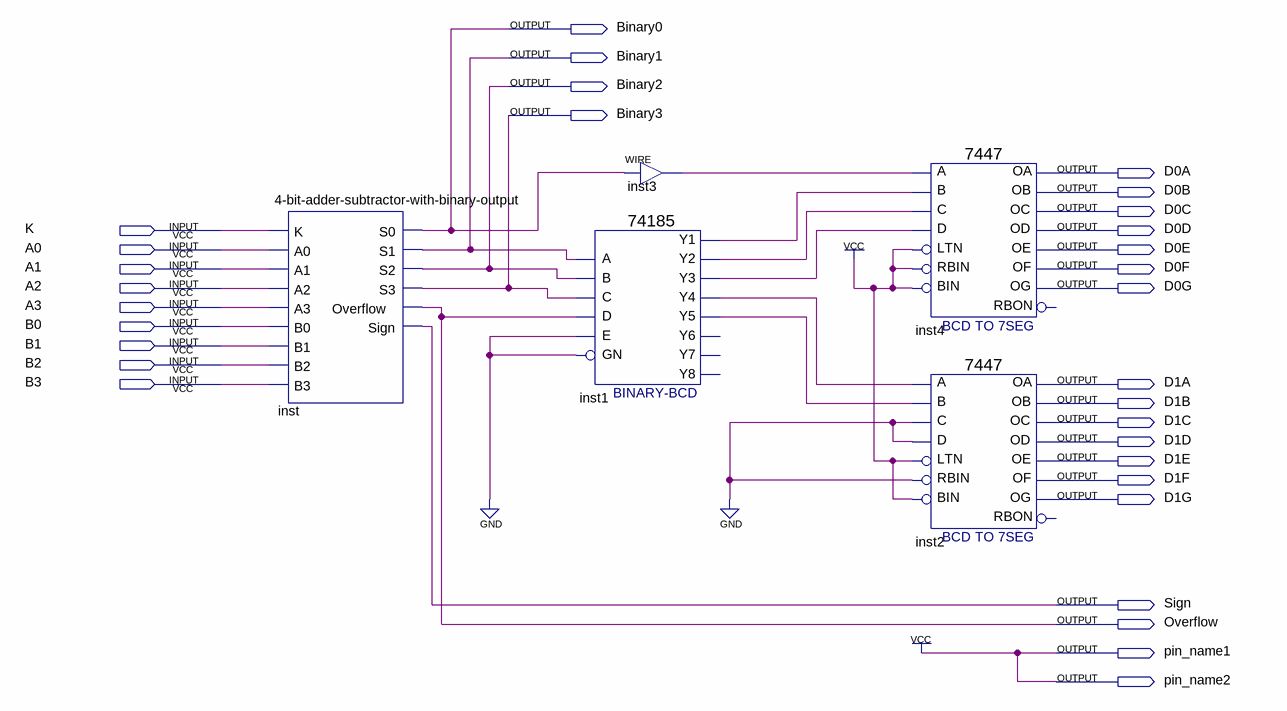
[diagram p0: schematic sheet]
// Quartus schematic 4-bit-adder-subtractor-with-7-seg-output.bdf as structural Verilog: 5 symbols, 31 pins
module \4-bit-adder-subtractor-with-7-seg-output  (
  input  K,
  input  A0,
  input  A1,
  input  A2,
  input  A3,
  input  B0,
  input  B1,
  input  B2,
  input  B3,
  output Binary0,
  output Binary1,
  output Binary2,
  output Binary3,
  output D0A,
  output D0B,
  output D0C,
  output D0D,
  output D0E,
  output D0F,
  output D0G,
  output D1A,
  output D1B,
  output D1C,
  output D1D,
  output D1E,
  output D1F,
  output D1G,
  output Sign,
  output Overflow,
  output pin_name1,
  output pin_name2
);

  wire inst1_y1, inst1_y2, inst1_y3, inst1_y4, inst1_y5, inst3_out;

  \4-bit-adder-subtractor-with-binary-output  inst (
    .K(K), .A0(A0), .A1(A1), .A2(A2), .A3(A3), .B0(B0), .B1(B1), .B2(B2), .B3(B3), .S0(Binary0),
    .S1(Binary1), .S2(Binary2), .S3(Binary3), .Overflow(Overflow), .Sign(Sign));
  assign inst3_out = Binary0;  // WIRE inst3
  \74185  inst1 (
    .A(Binary1), .B(Binary2), .D(Overflow), .C(Binary3), .E(1'b0), .GN(1'b0), .Y1(inst1_y1), .Y3(inst1_y3),
    .Y2(inst1_y2), .Y5(inst1_y5), .Y4(inst1_y4));  // open: Y6, Y8, Y7
  \7447  inst4 (
    .LTN(1'b1), .B(inst1_y1), .C(inst1_y2), .D(inst1_y3), .RBIN(1'b1), .BIN(1'b1), .A(inst3_out), .OB(D0B),
    .OC(D0C), .OE(D0E), .OD(D0D), .OF(D0F), .OG(D0G), .OA(D0A));  // open: RBON
  \7447  inst2 (
    .LTN(1'b1), .B(inst1_y5), .C(1'b0), .D(1'b0), .RBIN(1'b0), .BIN(1'b1), .A(inst1_y4), .OB(D1B), .OC(D1C),
    .OE(D1E), .OD(D1D), .OF(D1F), .OG(D1G), .OA(D1A));  // open: RBON

  assign pin_name1 = 1'b1;
  assign pin_name2 = 1'b1;
endmodule
